# Altium schematic sheet At Guard Simple.SchDoc
size D
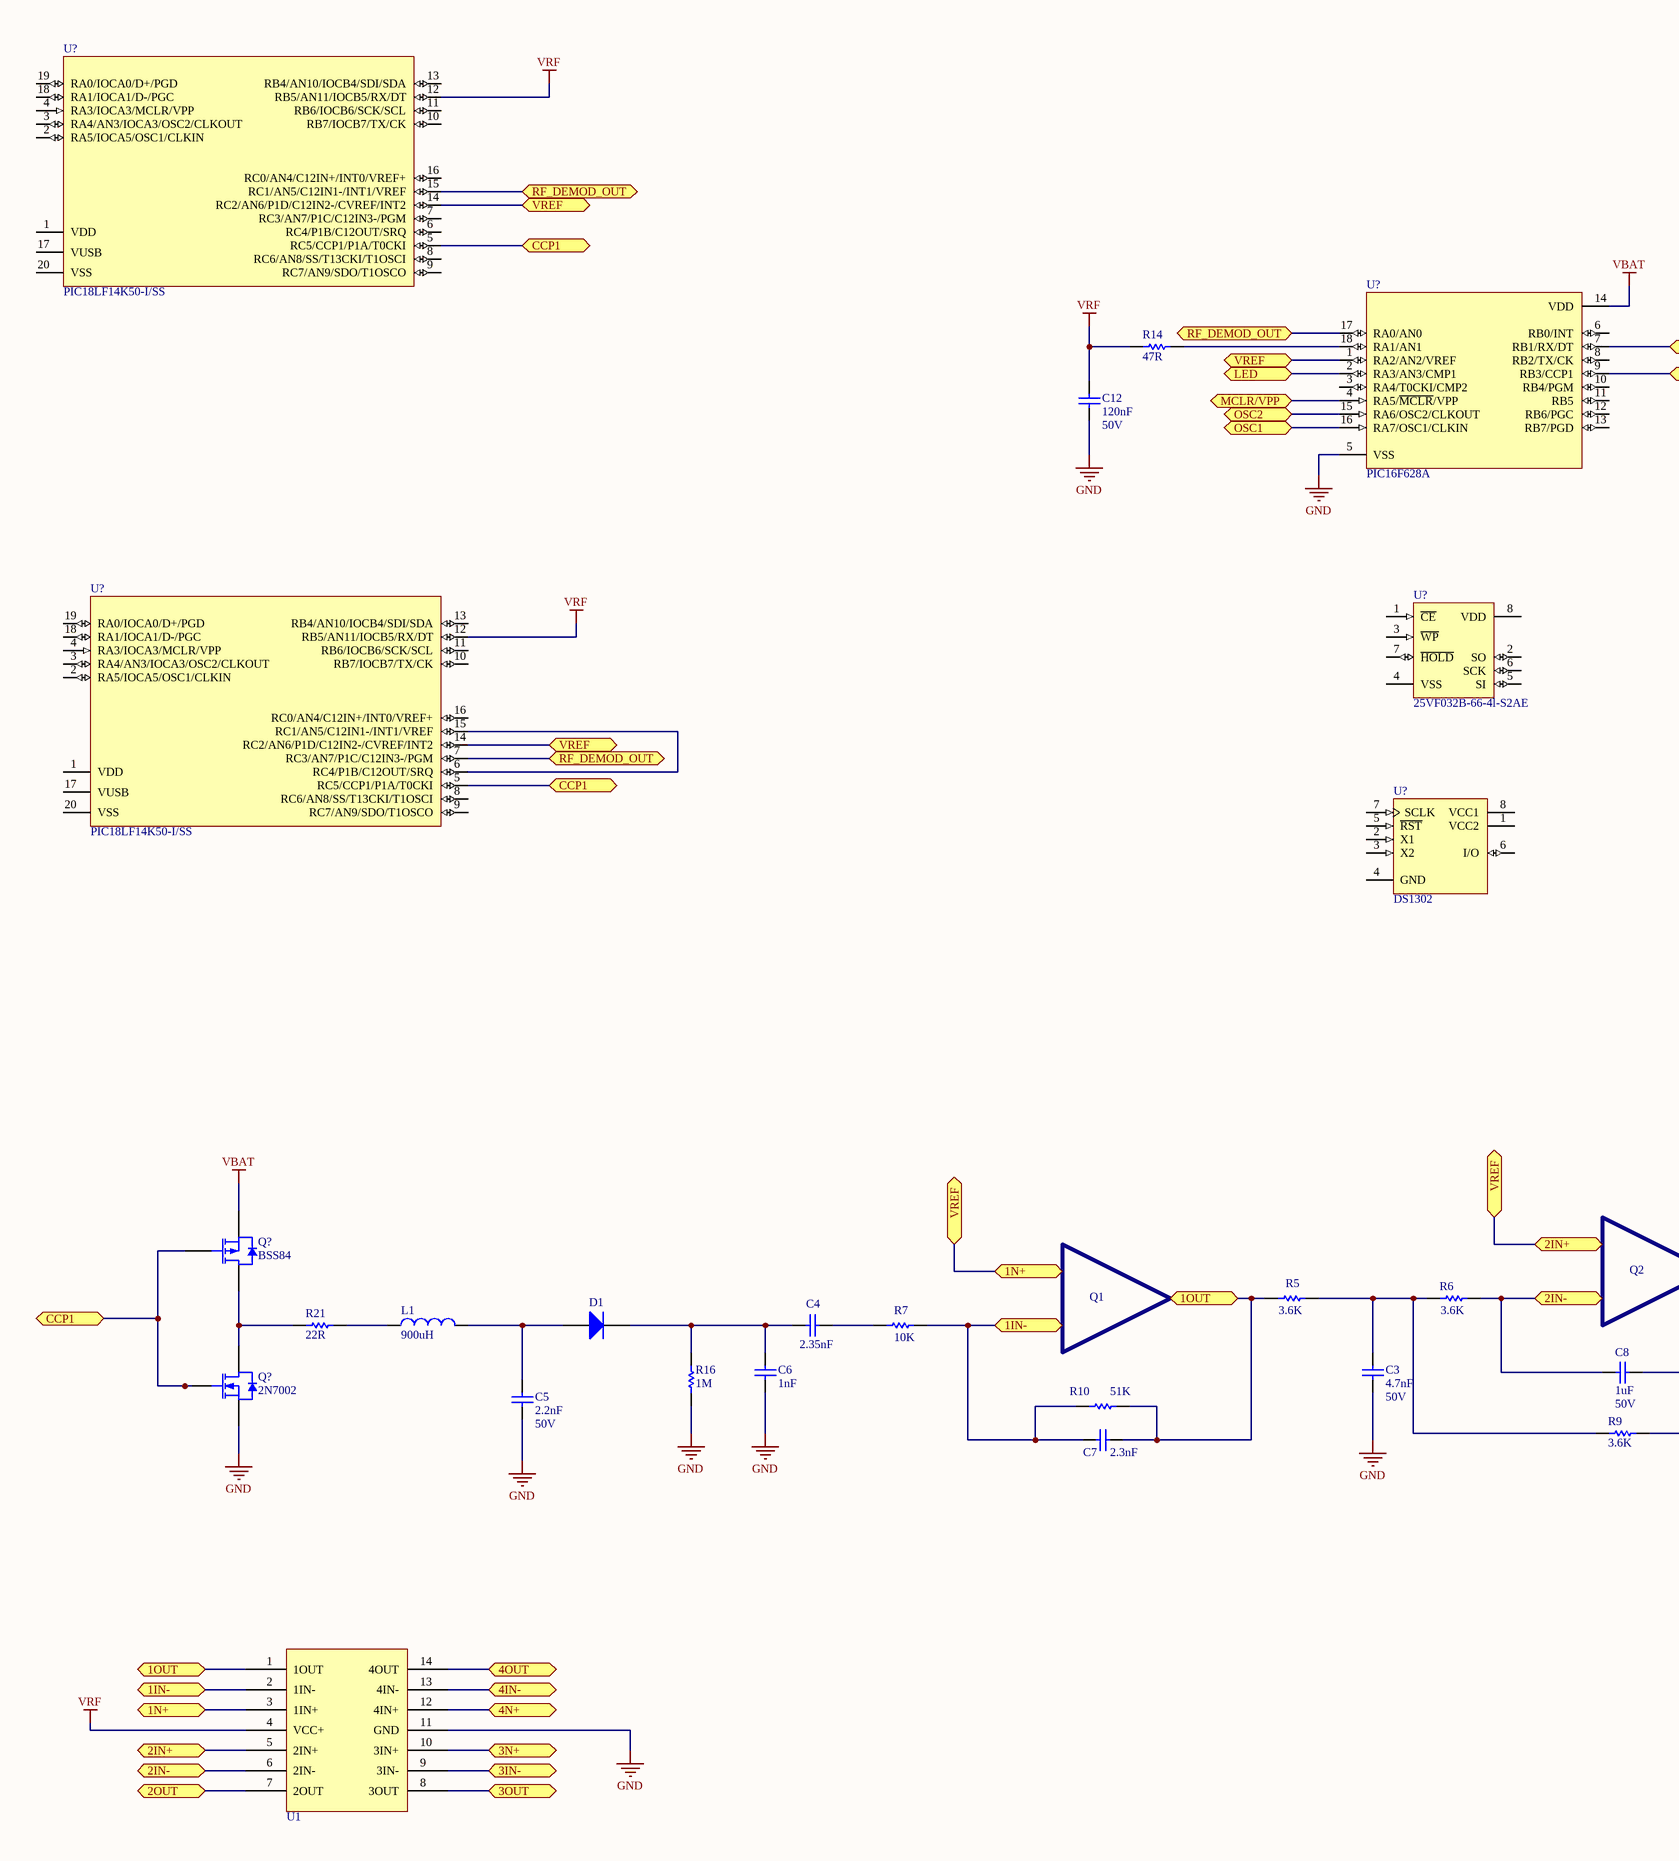
[diagram p0: At Guard Simple.SchDoc, left]
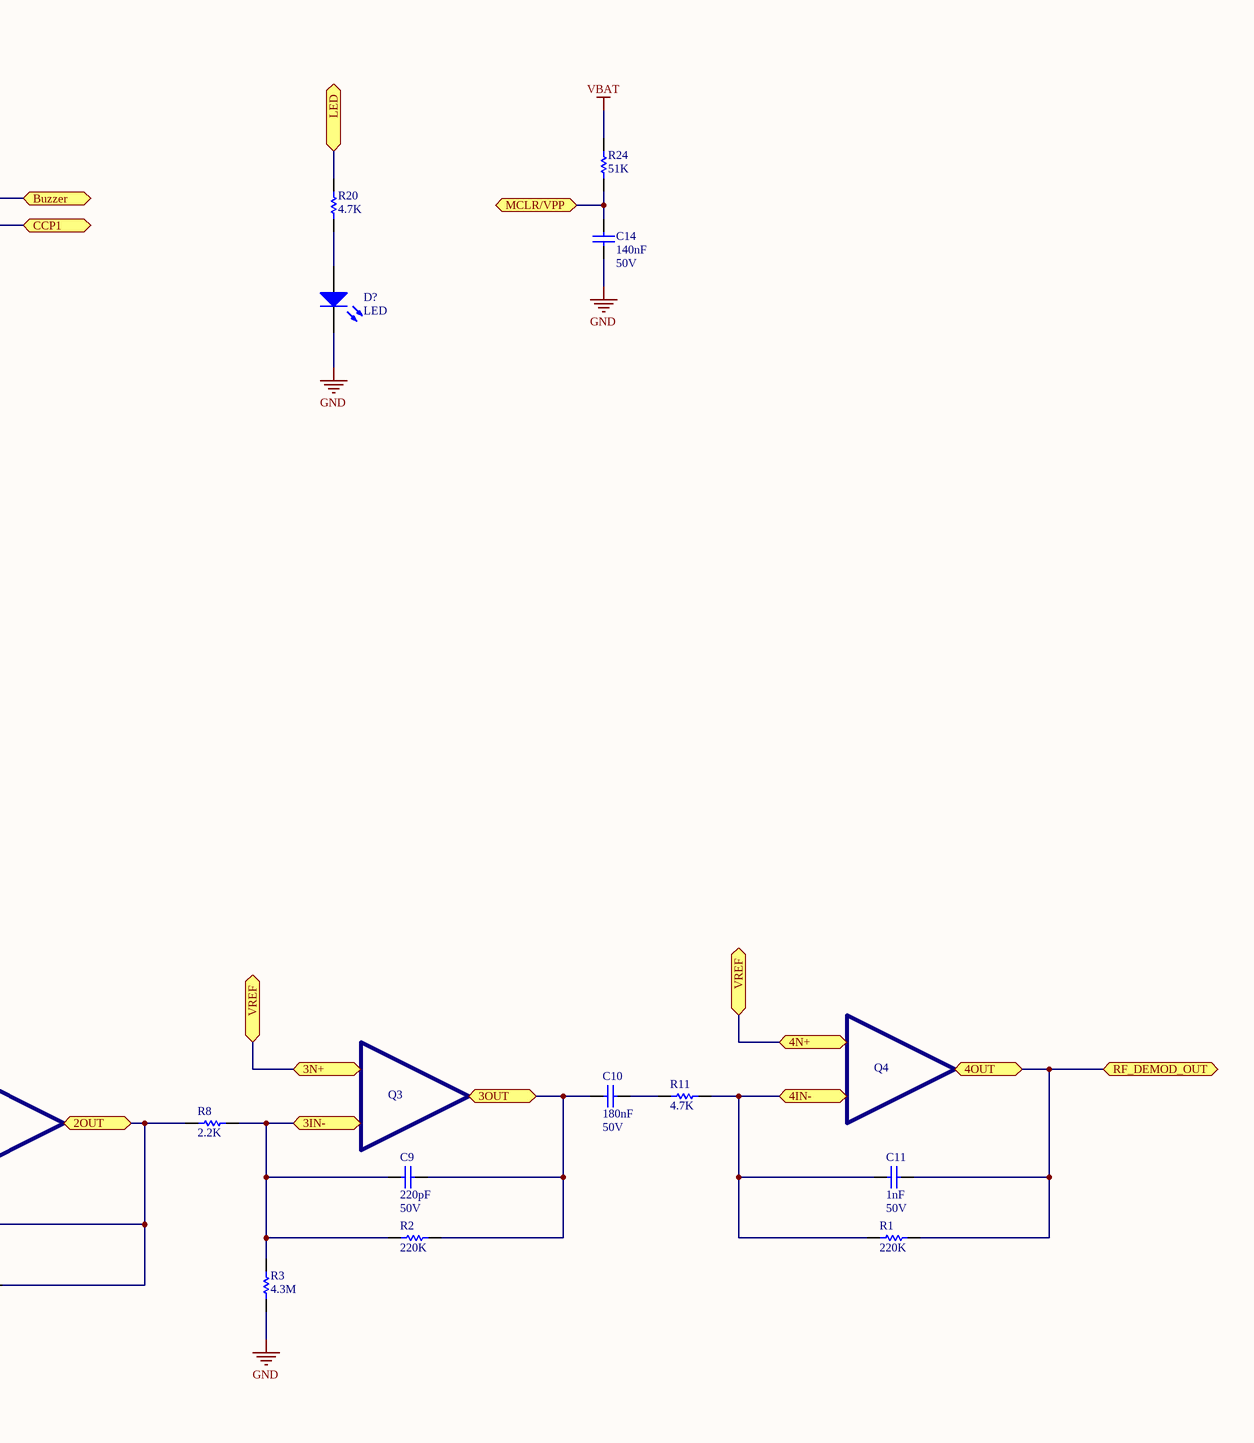
[diagram p1: At Guard Simple.SchDoc, right]

## Parts
(Parts that share a designator on the sheet are numbered #1, #2 ... from top to bottom, then left to right.)
C3  value 4.7nF  Voltage: 50V  [C 5x15mm]  (hidden comment: Cap)
C4  value 2.35nF  [C 5x15mm]  (hidden comment: Cap)
C5  value 2.2nF  Voltage: 50V  [6-0805 - big]  (hidden comment: Cap)
C6  value 1nF  [C 5x15mm]  (hidden comment: Cap)
C7  value 2.3nF  [C 5x15mm]  (hidden comment: Cap)
C8  value 1uF  Voltage: 50V  [C 5x15mm]  (hidden comment: Cap)
C9  value 220pF  Voltage: 50V  [C 5x15mm]  (hidden comment: Cap)
C10  value 180nF  Voltage: 50V  [C 5x15mm]  (hidden comment: Cap)
C11  value 1nF  Voltage: 50V  [C 5x15mm]  (hidden comment: Cap)
C12  value 120nF  Voltage: 50V  [C 5x15mm]  (hidden comment: Cap)
C14  value 140nF  Voltage: 50V  [C 5x15mm]  (hidden comment: Cap)
D1  Diode 1N4007  [DO-41]  (value not drawn)
D?  LED  [LED]
L1  value 900uH  [4.5x3.2mm SMD Bobin]  (hidden comment: Inductor)
Q?#1  BSS84  [SOT23_N]
Q?#2  2N7002  [SOT23_N]
R1  value 220K  [6-0805]  (hidden comment: Res1)
R2  value 220K  [6-0805]  (hidden comment: Res1)
R3  value 4.3M  [6-0805]  (hidden comment: Res1)
R5  value 3.6K  [6-0805]  (hidden comment: Res1)
R6  value 3.6K  [6-0805]  (hidden comment: Res1)
R7  value 10K  [6-0805]  (hidden comment: Res1)
R8  value 2.2K  [6-0805]  (hidden comment: Res1)
R9  value 3.6K  [6-0805]  (hidden comment: Res1)
R10  value 51K  [6-0805]  (hidden comment: Res1)
R11  value 4.7K  [6-0805]  (hidden comment: Res1)
R14  value 47R  [6-0805]  (hidden comment: Res1)
R16  value 1M  [6-0805]  (hidden comment: Res1)
R20  value 4.7K  [6-0805]  (hidden comment: Res1)
R21  value 22R  [6-0805]  (hidden comment: Res1)
R24  value 51K  [6-0805]  (hidden comment: Res1)
U1  LMV324IPWR  [TSSOP-14N]  (value not drawn)
U?#1  PIC18LF14K50-I/SS  [SSOP-20]
U?#2  PIC16F628A  [CERDIP300W-18]
U?#3  PIC18LF14K50-I/SS  [SSOP-20]
U?#4  25VF032B-66-4l-S2AE  [SOIJ-SM8_M]
U?#5  DS1302  [DIP8]

## Ports
1IN-, 1N+, 1OUT, 2IN+, 2IN-, 2OUT, 3IN-, 3N+, 3OUT, 4IN-, 4N+, 4OUT, Buzzer, CCP1, LED, MCLR/VPP, OSC1, OSC2, RF_DEMOD_OUT, VREF

## Nets
GND: C3.1 C5.1 C6.2 C12.2 C14.2 D?.2(K) Q?#2.2(S) R3.2 R16.2 U1.11(GND) U?#2.5(VSS)
VBAT: Q?#1.2(S) R24.1 U?#2.14(VDD)
VRF: C12.1 R14.2 U1.4(VCC+) U?#1.12(RB5/AN11/IOCB5/RX/DT) U?#3.12(RB5/AN11/IOCB5/RX/DT)
1IN-: C7.2 R7.1 R10.2 U1.2(1IN-) ; port 1IN-
1N+: U1.3(1IN+) U1.5(2IN+) U1.10(3IN+) U1.12(4IN+) U?#1.14(RC2/AN6/P1D/C12IN2-/CVREF/INT2) U?#2.1(RA2/AN2/VREF) U?#3.14(RC2/AN6/P1D/C12IN2-/CVREF/INT2) ; port 2IN+, port 1N+, port 4N+, port 3N+, port VREF
1OUT: C7.1 R5.1 R10.1 U1.1(1OUT) ; port 1OUT
2IN-: C8.2 R6.2 U1.6(2IN-) ; port 2IN-
2OUT: C8.1 R8.2 R9.1 U1.7(2OUT) ; port 2OUT
3IN-: C9.2 R2.2 R3.1 R8.1 U1.9(3IN-) ; port 3IN-
3OUT: C9.1 C10.2 R2.1 U1.8(3OUT) ; port 3OUT
4IN-: C11.2 R1.2 R11.1 U1.13(4IN-) ; port 4IN-
4OUT: C11.1 R1.1 U1.14(4OUT) U?#1.15(RC1/AN5/C12IN1-/INT1/VREF) U?#2.17(RA0/AN0) U?#3.7(RC3/AN7/P1C/C12IN3-/PGM) ; port 4OUT, port RF_DEMOD_OUT
Buzzer: U?#2.7(RB1/RX/DT) ; port Buzzer
CCP1: Q?#1.1(G) Q?#2.1(G) U?#1.5(RC5/CCP1/P1A/T0CKI) U?#2.9(RB3/CCP1) U?#3.5(RC5/CCP1/P1A/T0CKI) ; port CCP1
LED: R20.1 U?#2.2(RA3/AN3/CMP1) ; port LED
MCLR/VPP: C14.1 R24.2 U?#2.4(RA5/~{MCLR}/VPP) ; port MCLR/VPP
OSC1: U?#2.16(RA7/OSC1/CLKIN) ; port OSC1
OSC2: U?#2.15(RA6/OSC2/CLKOUT) ; port OSC2
NetC3_2: C3.2 R5.2 R6.1 R9.2
NetC4_1: C4.1 R7.2
NetC4_2: C4.2 C6.1 D1.2(K) R16.1
NetC5_2: C5.2 D1.1(A) L1.1
NetC10_1: C10.1 R11.2
NetD?_1: D?.1(A) R20.2
NetL1_2: L1.2 R21.2
NetQ?#1_3: Q?#1.3(D) Q?#2.3(D) R21.1
NetR14_1: R14.1 U?#2.18(RA1/AN1)
NetU?#3_6: U?#3.6(RC4/P1B/C12OUT/SRQ) U?#3.15(RC1/AN5/C12IN1-/INT1/VREF)

Not connected (* = marked no-connect by the designer): U?#1 1(VDD) 2(RA5/IOCA5/OSC1/CLKIN) 3(RA4/AN3/IOCA3/OSC2/CLKOUT) 4(RA3/IOCA3/MCLR/VPP) 6(RC4/P1B/C12OUT/SRQ) 7(RC3/AN7/P1C/C12IN3-/PGM) 8(RC6/AN8/SS/T13CKI/T1OSCI) 9(RC7/AN9/SDO/T1OSCO) 10(RB7/IOCB7/TX/CK) 11(RB6/IOCB6/SCK/SCL) 13(RB4/AN10/IOCB4/SDI/SDA) 16(RC0/AN4/C12IN+/INT0/VREF+) 17(VUSB) 18(RA1/IOCA1/D-/PGC) 19(RA0/IOCA0/D+/PGD) 20(VSS); U?#2 3(RA4/T0CKI/CMP2) 6(RB0/INT) 8(RB2/TX/CK) 10(RB4/PGM) 11(RB5) 12(RB6/PGC) 13(RB7/PGD); U?#3 1(VDD) 2(RA5/IOCA5/OSC1/CLKIN) 3(RA4/AN3/IOCA3/OSC2/CLKOUT) 4(RA3/IOCA3/MCLR/VPP) 8(RC6/AN8/SS/T13CKI/T1OSCI) 9(RC7/AN9/SDO/T1OSCO) 10(RB7/IOCB7/TX/CK) 11(RB6/IOCB6/SCK/SCL) 13(RB4/AN10/IOCB4/SDI/SDA) 16(RC0/AN4/C12IN+/INT0/VREF+) 17(VUSB) 18(RA1/IOCA1/D-/PGC) 19(RA0/IOCA0/D+/PGD) 20(VSS); U?#4 1(~{CE}) 2(SO) 3(~{WP}) 4(VSS) 5(SI) 6(SCK) 7(~{HOLD}) 8(VDD); U?#5 1(VCC2) 2(X1) 3(X2) 4(GND) 5(~{RST}) 6(I/O) 7(SCLK) 8(VCC1)

## Notes on the sheet
- Q3
- Q4
- Q1
- Q2

## Library data of the parts
C3 C5 C8-C12 C14 = Cap: Capacitor; Published: 8-Jun-2000; Revision: July-2002: Re-released for DXP Platform.; Publisher: Altium Limited
C4 C6 C7 = Cap: Capacitor; Voltage: 50V; Published: 8-Jun-2000; Revision: July-2002: Re-released for DXP Platform.; Publisher: Altium Limited
D1 = Diode 1N4007: 1 Amp General Purpose Rectifier; Published: 8-Jun-2000; LatestRevisionDate: 17-Jul-2002; LatestRevisionNote: Re-released for DXP Platform.; DatasheetDocument: 1998; PackageDocument: Aug-1999; PackageReference: DO-41; Publisher: Altium Limited; Code_JEDEC: DO-204-AL; ComponentLink1Description: Manufacturer Link; ComponentLink1URL: http://www.fairchildsemi.com/; ComponentLink2Description: Datasheet; ComponentLink2URL: http://www.fairchildsemi.com/ds/1N%2F1N4001.pdf
D? = LED: Typical INFRARED GaAs LED; Published: 8-Jun-2000; LatestRevisionDate: 08-Jul-2005; LatestRevisionNote: Mech Layer 1 removed.; PackageReference: LED-0; Publisher: Altium Limited
L1 = Inductor: Code_IEC: 1005; Published: 8-Jun-2000; LatestRevisionDate: 17-Jul-2002; LatestRevisionNote: Re-released for DXP Platform.; PackageReference: 0402-A; Publisher: Altium Limited; Code_JEITA: 0402
Q?#1 = BSS84: P-channel Enhancement Mode Vertical D-MOSFET; Published: 17-Sep-2003; LatestRevisionDate: 12-Dec-2006; LatestRevisionNote: IPC-7351 Footprint Added.; DatasheetVersion: 18-Jun-1997; PackageVersion: May-1999; PackageReference: SOT23; Publisher: Altium Limited; PackageDescription: 3-Pin SOT-23 Package 0.95 mm Pitch, 2.3 mm Lead Span; ComponentLink1Description: Manufacturer Link; ComponentLink1URL: http://www.semiconductors.philips.com/; ComponentLink2Description: Datasheet; ComponentLink2URL: http://www.semiconductors.philips.com/acrobat/datasheets/BSS84_3.pdf
Q?#2 = 2N7002: N-channel Enhancement Mode Field-effect Transistor; Published: 17-Sep-2003; LatestRevisionDate: 12-Dec-2006; LatestRevisionNote: IPC-7351 Footprint Added.; DatasheetVersion: 27-Jul-2000; PackageVersion: May-1999; PackageReference: SOT23; Publisher: Altium Limited; PackageDescription: 3-Pin SOT-23 Package 0.95 mm Pitch, 2.3 mm Lead Span; ComponentLink1Description: Manufacturer Link; ComponentLink1URL: http://www.semiconductors.philips.com/; ComponentLink2Description: Datasheet; ComponentLink2URL: http://www.semiconductors.philips.com/acrobat/datasheets/2N7002_4.pdf
R1-R3 R5-R11 R14 R16 R20 R21 R24 = Res1: Resistor; Published: 8-Jun-2000; LatestRevisionDate: 17-Jul-2002; LatestRevisionNote: Re-released for DXP Platform.; PackageReference: AXIAL-0.3; Publisher: Altium Limited
U1 = LMV324IPWR: IC OPAMP GP R-R 1MHZ 14TSSOP; Manufacturer: Texas Instruments; .Checked PCB: *; .Checked SCH: *; Category: Integrated Circuits (ICs); Digi-Key Part Number: 296-9570-2-ND; Manufacturer Part Number: LMV324IPWR; Package / Case: 14-TSSOP (0.173", 4.40mm Width); Family: Linear - Amplifiers - Instrumentation, OP Amps, Buffer Amps; Price 1k [$]: 0.14375; Standard Package: 2000
U?#1 U?#3 = PIC18LF14K50-I/SS: High Performance, Enhanced FLASH Microcontroller with 10-Bit A/D and nanoWatt Technology, 8K FLASH, 20-Pin SSOP, Standard Volt Range, Industrial Temperature; Note: RA5 is available only when the M\C\L\R\ Resets are disabled.; Note: OSC1, OSC2, CLKI and CLKO are only available in select Oscillator modes and when these pins are not being used as digital I/O.; Published: 11-Oct-2004; LatestRevisionDate: 04-Mar-2005; LatestRevisionNote: Stylized 3D Model Added.; DatasheetVersion: DS39605B_2002; PackageVersion: 2003; PackageReference: SSOP-20; Publisher: Altium Limited; PackageDescription: SSOP, Plastic; 20 Leads; Body Width 5.3 mm; Pitch 0.65 mm; Code_JEDEC: MO-150; ComponentLink1Description: Manufacturer Link; ComponentLink1URL: http://www.microchip.com; ComponentLink2Description: Datasheet; ComponentLink2URL: http://ww1.microchip.com/downloads/en/DeviceDoc/39605b.pdf; ComponentLink3Description: Packaging Specification; ComponentLink3URL: http://ww1.microchip.com/downloads/en/PackagingSpec/00049AD.pdf
U?#2 = PIC16F628A: EPROM-Based 8-Bit CMOS Microcontroller; Package Information: Latest Revision: 1998; Published: 8-Jun-2000; Revision: 17-Jul-2002: Re-released for DXP Platform.; Datasheet: Latest Revision: 1998; Package Reference: JW18; Publisher: Altium Limited
U?#4 = 25VF032B-66-4l-S2AE: SPI Flash 32Mbit; Published: 29-Jan-2009; DatasheetVersion: revE, Mar-2007; PackageVersion: revAW, Oct-2008; PackageReference: SOIJ-SM8; Publisher: Altium Limited; PackageDescription: 8-Lead Plastic Small Outline (SM) - Medium, 5.28 mm Body [SOIJ]; ComponentLink1Description: Manufacturer Link; ComponentLink1URL: http://www.microchip.com; ComponentLink2Description: Datasheet; ComponentLink2URL: http://ww1.microchip.com/downloads/en/DeviceDoc/21941E.pdf; ComponentLink3Description: Packaging Specification; ComponentLink3URL: http://ww1.microchip.com/downloads/en/PackagingSpec/00049AW.pdf
U?#5 = DS1302: Trickle Charge Timekeeping Chip; Published: 13-Oct-2000; LatestRevisionDate: 06-Jun-2005; LatestRevisionNote: Stylized 3D Model Added.; DatasheetVersion: 2-Jul-1999; PackageVersion: 1999; PackageReference: DIP8; Publisher: Altium Limited; PackageDescription: DIP; 8 Leads; Row Spacing 7.62 mm; Pitch 2.54 mm; ComponentLink1Description: Manufacturer Link; ComponentLink1URL: http://www.maxim-ic.com/; ComponentLink2Description: Datasheet; ComponentLink2URL: http://pdfserv.maxim-ic.com/en/ds/DS1302.pdf